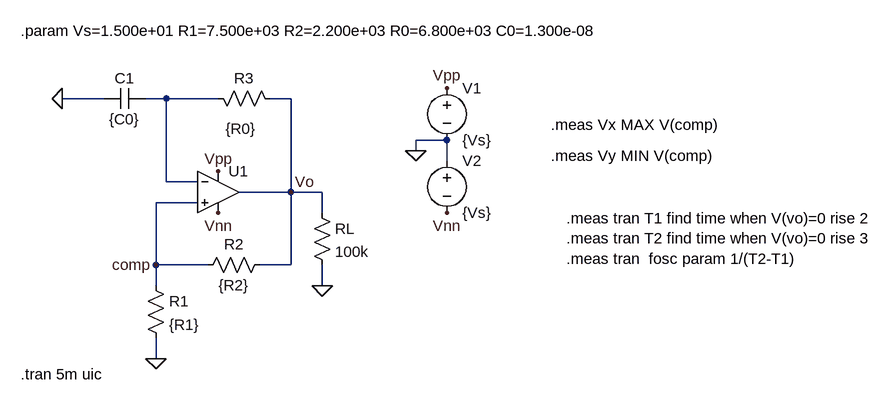
[diagram p0: schematic CompHisterese.asc]
CompHisterese.asc, the LTspice schematic file:
Version 4
SHEET 1 1212 680
WIRE -16 80 -80 80
WIRE 80 80 48 80
WIRE 160 80 80 80
WIRE 272 80 240 80
WIRE 512 144 464 144
WIRE 464 160 464 144
WIRE 512 176 512 144
WIRE 80 208 80 80
WIRE 128 208 80 208
WIRE 272 224 272 80
WIRE 272 224 192 224
WIRE 320 224 272 224
WIRE 128 240 64 240
WIRE 320 256 320 224
WIRE 64 336 64 240
WIRE 144 336 64 336
WIRE 272 336 272 224
WIRE 272 336 224 336
WIRE 64 368 64 336
WIRE 320 368 320 336
WIRE 64 480 64 448
FLAG 512 64 Vpp
FLAG 464 160 0
FLAG 512 256 Vnn
FLAG 320 368 0
FLAG 64 480 0
FLAG 272 224 Vo
FLAG 160 192 Vpp
FLAG 160 256 Vnn
FLAG 64 336 comp
FLAG -80 80 0
SYMBOL voltage 512 48 R0
WINDOW 123 0 0 Left 0
WINDOW 39 0 0 Left 0
SYMATTR InstName V1
SYMATTR Value {Vs}
SYMBOL voltage 512 160 R0
WINDOW 123 0 0 Left 0
WINDOW 39 0 0 Left 0
SYMATTR InstName V2
SYMATTR Value {Vs}
SYMBOL res 304 240 R0
SYMATTR InstName RL
SYMATTR Value 100k
SYMBOL res 240 320 R90
WINDOW 0 0 56 VBottom 2
WINDOW 3 32 56 VTop 2
SYMATTR InstName R2
SYMATTR Value {R2}
SYMBOL res 48 352 R0
SYMATTR InstName R1
SYMATTR Value {R1}
SYMBOL Opamps\\UniversalOpamp2 160 224 R0
SYMATTR InstName U1
SYMBOL cap 48 64 R90
WINDOW 0 0 32 VBottom 2
WINDOW 3 32 32 VTop 2
SYMATTR InstName C1
SYMATTR Value {C0}
SYMBOL res 144 64 M90
WINDOW 0 0 56 VBottom 2
WINDOW 3 47 51 VTop 2
SYMATTR InstName R3
SYMATTR Value {R0}
TEXT -144 -24 Left 2 !.param Vs=1.500e+01 R1=7.500e+03 R2=2.200e+03 R0=6.800e+03 C0=1.300e-08
TEXT 672 120 Left 2 !.meas Vx MAX V(comp)
TEXT 672 168 Left 2 !.meas Vy MIN V(comp)
TEXT 696 264 Left 2 !.meas tran T1 find time when V(vo)=0 rise 2\n.meas tran T2 find time when V(vo)=0 rise 3\n.meas tran  fosc param 1/(T2-T1)
TEXT -144 504 Left 2 !.tran 5m uic

The netlist it stands for:
* CompHisterese.asc
V1 Vpp 0 {Vs}
V2 0 Vnn {Vs}
RL Vo 0 100k
R2 Vo comp {R2}
R1 comp 0 {R1}
XU1 comp N001 Vpp Vnn Vo level.2 Avol=1Meg GBW=10Meg Slew=10Meg ilimit=25m rail=0 Vos=0 phimargin=45 en=0 enk=0 in=0 ink=0 Rin=500Meg  ; pins IN+ IN- V+ V- OUT
C1 N001 0 {C0}
R3 N001 Vo {R0}
.param Vs=1.500e+01 R1=7.500e+03 R2=2.200e+03 R0=6.800e+03 C0=1.300e-08
.meas Vx MAX V(comp)
.meas Vy MIN V(comp)
.meas tran T1 find time when V(vo)=0 rise 2
.meas tran T2 find time when V(vo)=0 rise 3
.meas tran  fosc param 1/(T2-T1)
.tran 5m uic
.lib UniversalOpamps2.sub
.backanno
.end